# EAGLE design MOSFET (EAGLE 9.6.2)
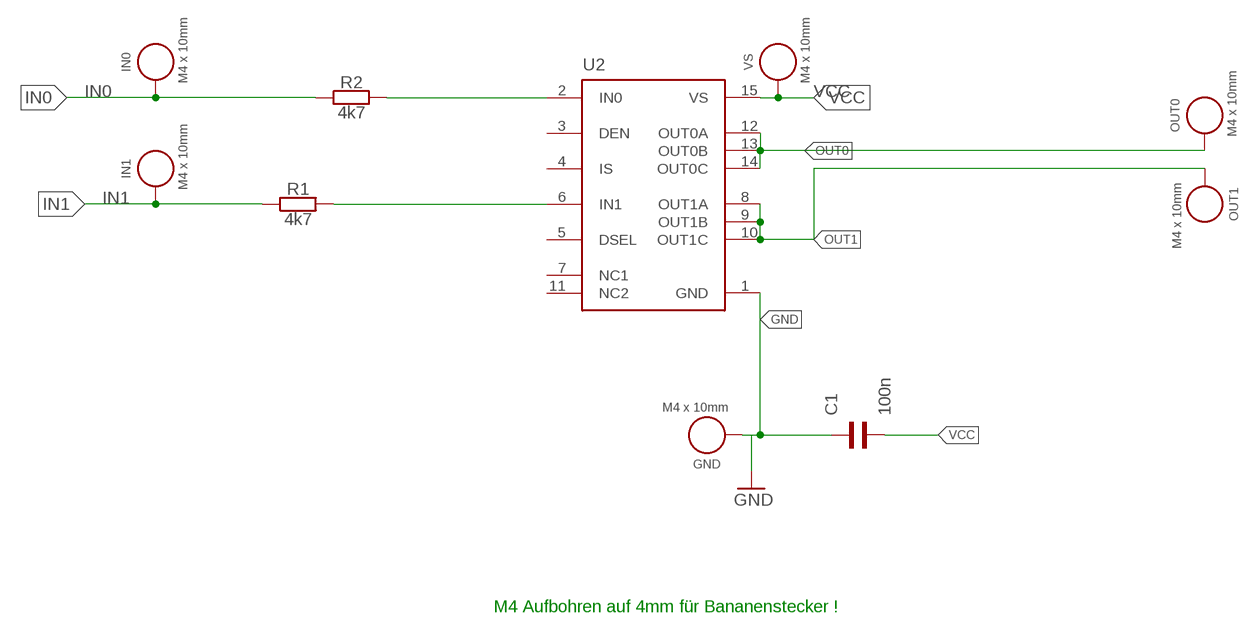
[diagram p0: schematic, sheet 1]

## Parts
C1  100n  WCAP-CSGP_0402_885012205037  [WCAP-CSGP_0402]
GND  M4 x 10mm  WA-SMSI_9774XXX482_9774100482  [WA-SMSI_9774100482]
IN0  M4 x 10mm  WA-SMSI_9774XXX482_9774100482  [WA-SMSI_9774100482]
IN1  M4 x 10mm  WA-SMSI_9774XXX482_9774100482  [WA-SMSI_9774100482]
OUT0  M4 x 10mm  WA-SMSI_9774XXX482_9774100482  [WA-SMSI_9774100482]
OUT1  M4 x 10mm  WA-SMSI_9774XXX482_9774100482  [WA-SMSI_9774100482]
R1  4k7  R-EU_WCAP-CSGP_0402  [WCAP-CSRF_0402]
R2  4k7  R-EU_WCAP-CSGP_0402  [WCAP-CSRF_0402]
U2  BTS7030-2EPA  [SOP65P600X115-15N-V]
VS  M4 x 10mm  WA-SMSI_9774XXX482_9774100482  [WA-SMSI_9774100482]

## Nets
GND: C1.2 GND.1 U2.1(GND)
IN0: IN0.1 R2.1
IN1: IN1.1 R1.1
N$16: R2.2 U2.2(IN0)
N$18: R1.2 U2.6(IN1)
OUT0: OUT0.1 U2.12(OUT0A) U2.13(OUT0B) U2.14(OUT0C)
OUT1: OUT1.1 U2.8(OUT1A) U2.9(OUT1B) U2.10(OUT1C)
VCC: C1.1 U2.15(VS) VS.1
Unconnected: U2.3(DEN) U2.4(IS) U2.5(DSEL) U2.7(NC1) U2.11(NC2)

## Notes on the sheet
- M4 Aufbohren auf 4mm für Bananenstecker !

## Library data of the parts
C1 = Wurth_Elektronik_Passive_Capacitors_rev19a:WCAP-CSGP_0402: WCAP-CSGP Ceramic Capacitors Characteristics Multilayer Ceramic Chip Capacitor Recommended soldering:Reflow, for 0603 and 0805 wave soldering is also allowed Operating temperature:-55 °C to +125 °C; Ceramic characteristics: Class I - NPO ; Class II -X7R, X5R High performance ceramic High capacitance stability Minimal aging Termination:Cu/Ni/Sn <http://katalog.we-online.de/media/images/eisos/WCAP-CSGP_pf2.jpg> Details see: http://katalog.we-online.de/en/pbs/WCAP-CSGP-0402? Created: 2015-01-28 2015 (C) Wurth Elektronik
GND IN0 IN1 OUT0 OUT1 VS = Wurth_Assembly_WA-SMSI:WA-SMSI_9774XXX482: WA-SMSI Steel Spacer with internal Thread M4 Applications Assembling of PCBs to housing and to other PCBs For distances from 1 to 10 mm Fast and precise process Strong holding forces and torques Highest process reliability Instant removable Polyimide Tape Properties Material Steel Surface Tin Ti M4 Solder Paste Thickness 150 µm Tightening Torque (Value) 1.2 N*m General Information Operating Temperature -55 up to +150 °C °C <https://www.we-online.com/catalog/media/o92909v209%20Family_WA_SMSI_M3.jpg> Details see: https://www.we-online.com/catalog/en/SMSI_SMT_STEEL_SPACER_M4_THREAD_INTERNAL Updated by Ella Wu 2021-06-03 2021(C) Wurth Elektronik; DATASHEET-URL: https://www.we-online.com/catalog/datasheet/9774100482.pdf; INNER-DIAMETER: 5.2mm; INNER-THREAD-LENGTH: -; OUTER-DIAMETER: 8.2mm; PART-NUMBER: 9774100482; PIN-LENGTH: 10mm; THREAD: M4
R1 R2 = Resistor_smaller_fliegl:R-EU_: RESISTOR, European symbol
U2 = BTS7030-2EPA:BTS7030-2EPA: BTS7030-2EPA PROFET +2, Smart High-Side Power Switch 30 mOhm Dual Channel SOP65P600X115-15N-V

## Board
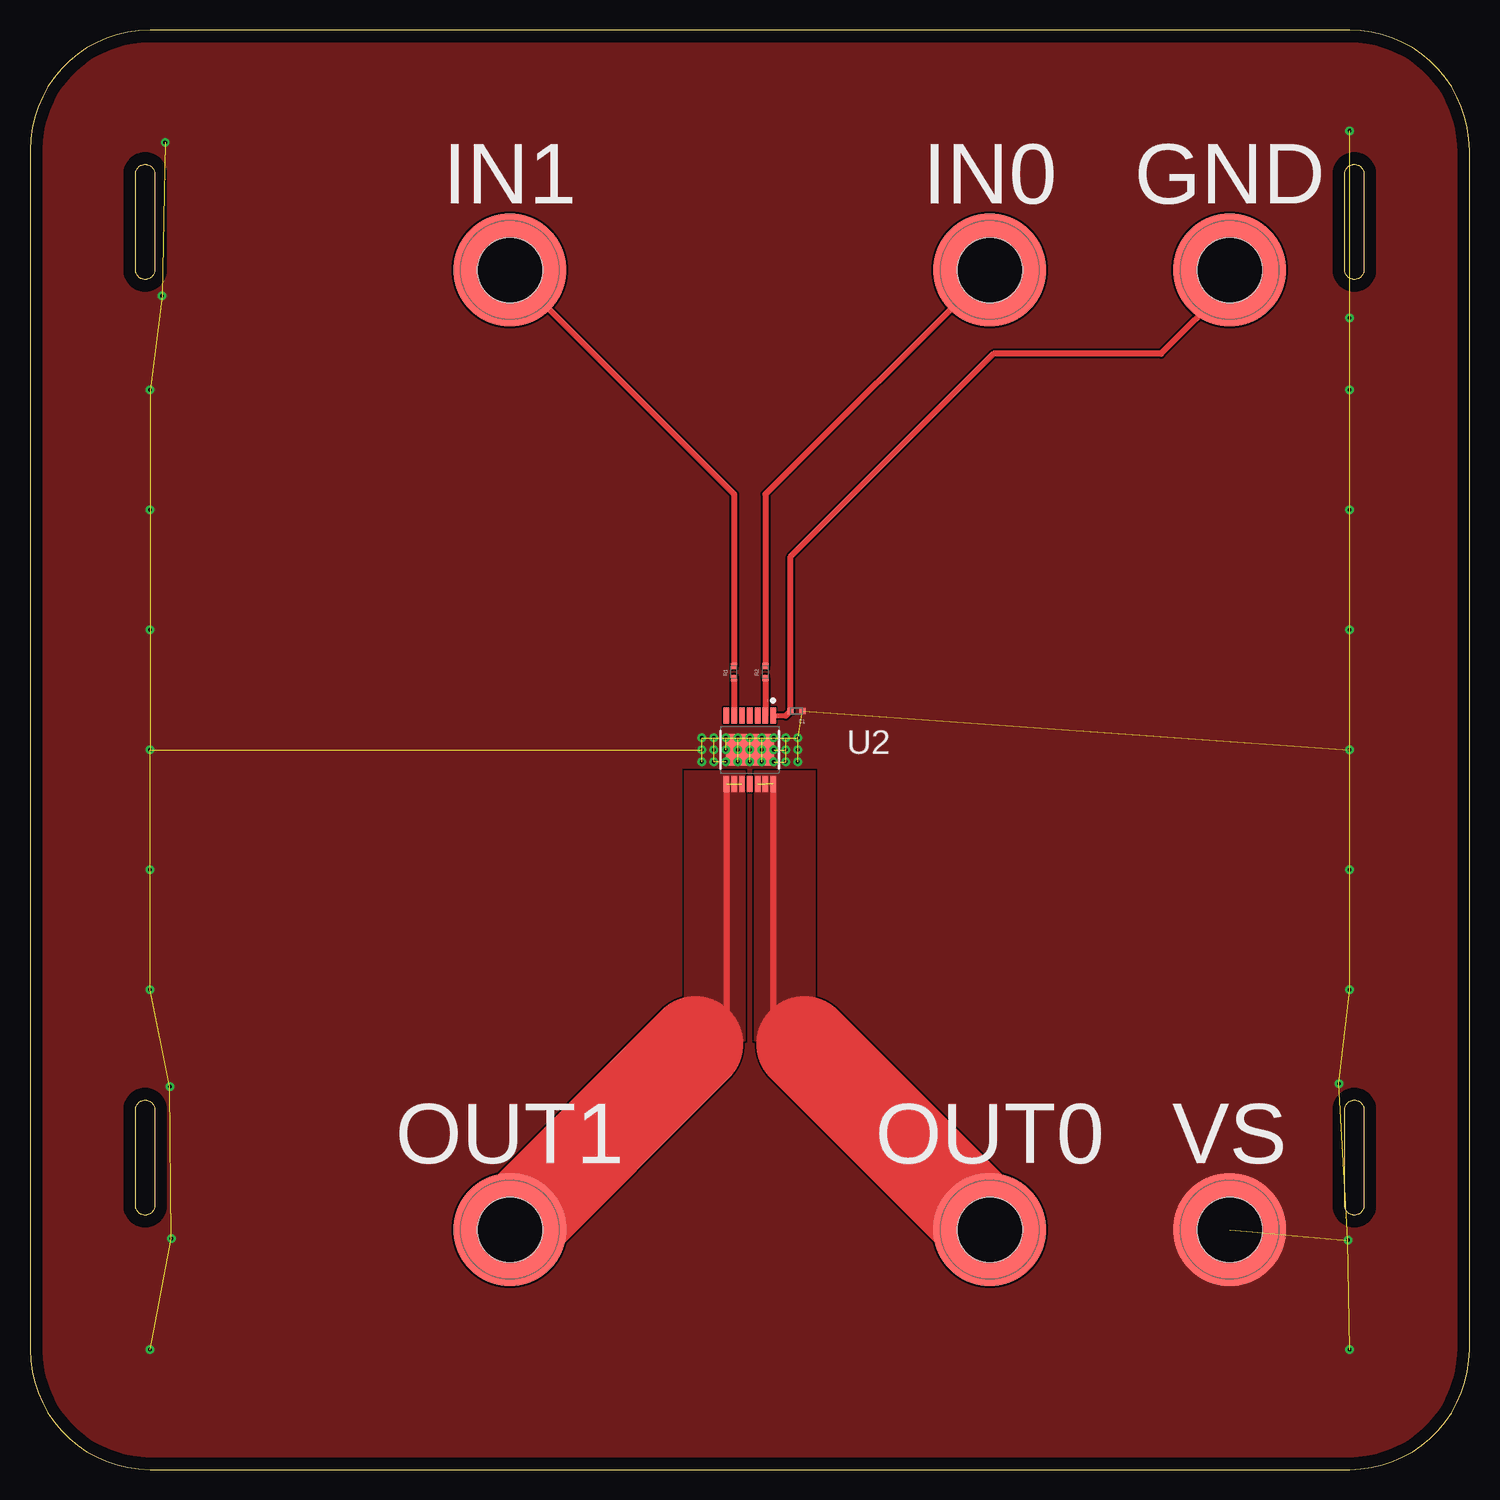
[diagram p1: board, top side]
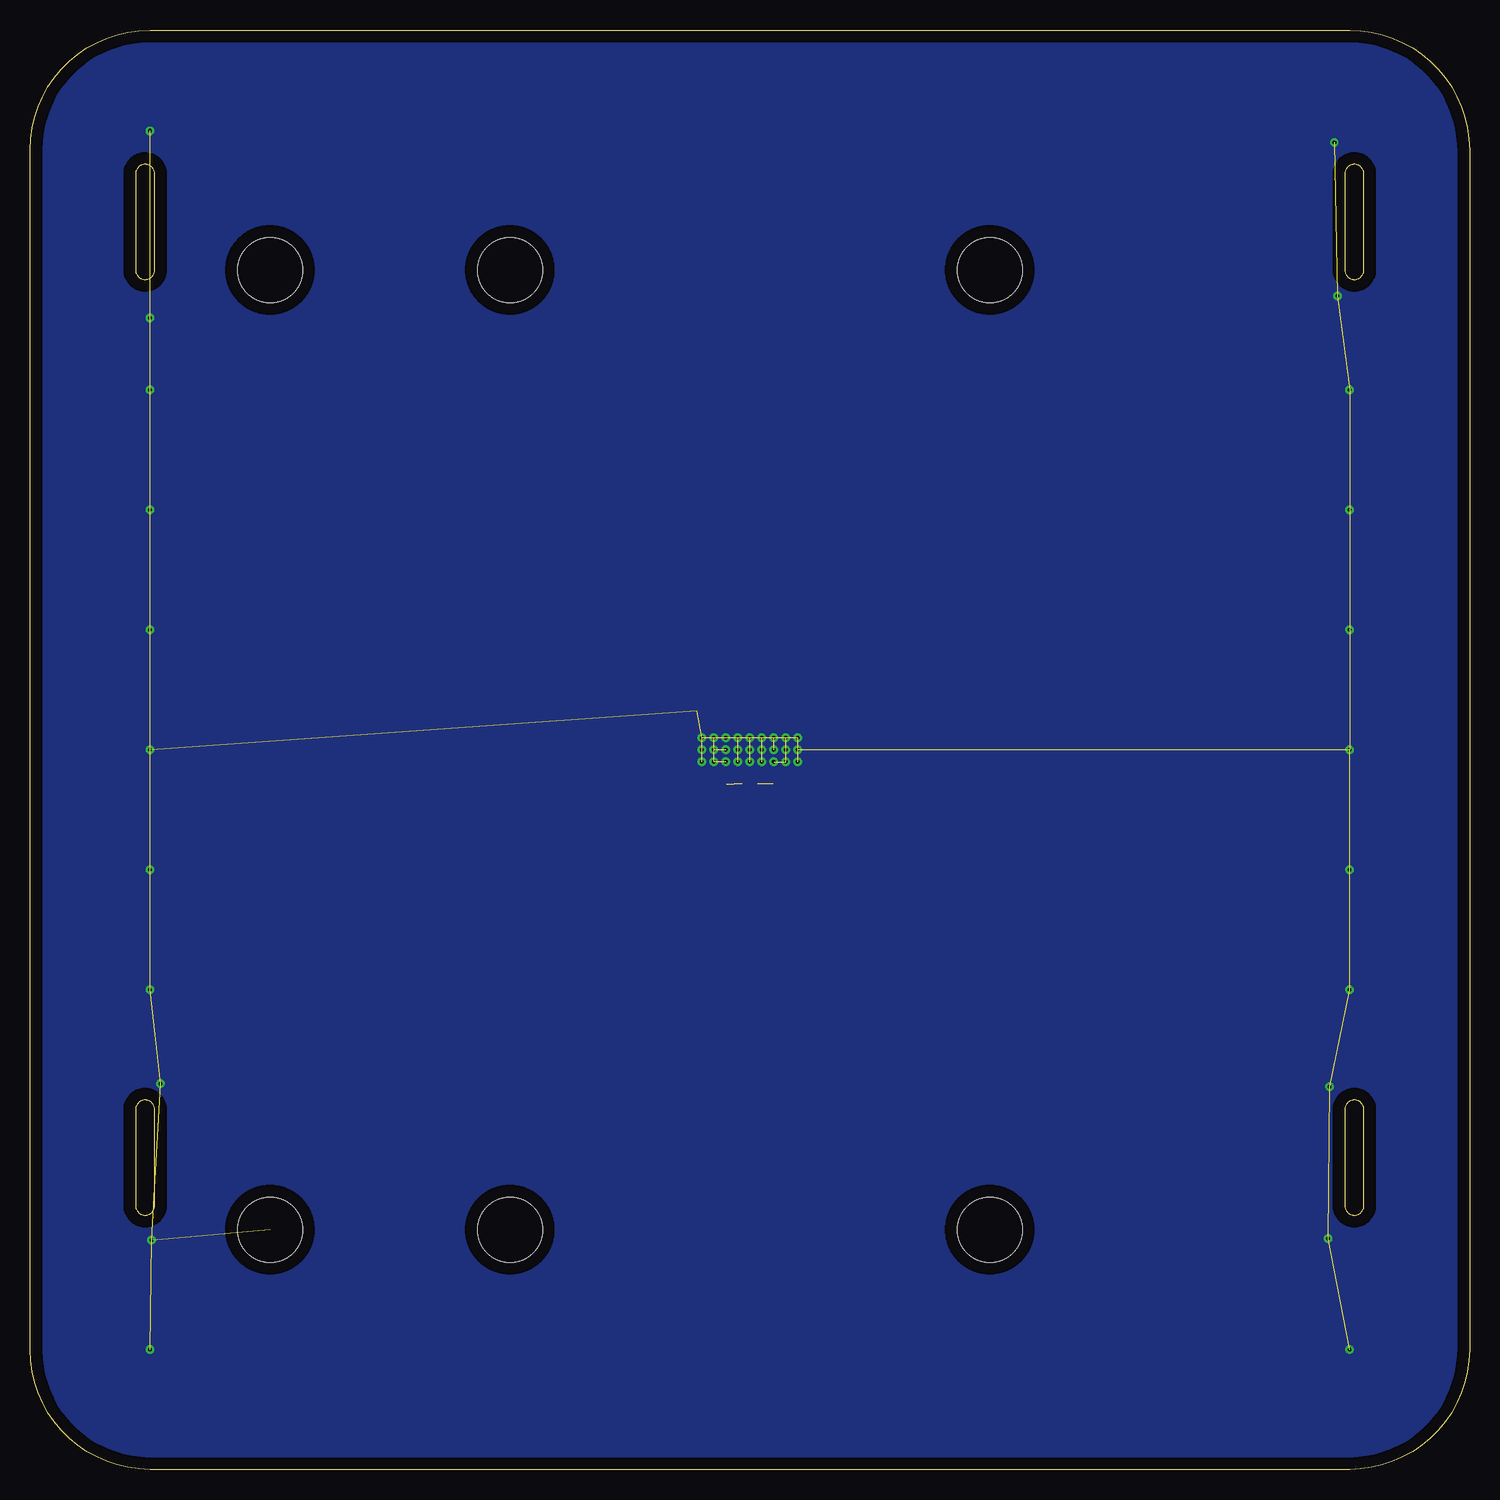
[diagram p2: board, bottom side, seen from below]

Size 120 x 120 mm. Coordinates in mm from the lower left corner, seen from the top.
Outline: 0,110 0,10 arc90 10,0 110,0 arc90 120,10 120,110 arc90 110,120 10,120 arc90 0,110
Outline: 110.4,99.2 arc-90 109.6,100 109.6,108 arc-90 110.4,108.8 arc-90 111.2,108 111.2,100 arc-90 110.4,99.2
Outline: 110.4,21.2 arc-90 109.6,22 109.6,30 arc-90 110.4,30.8 arc-90 111.2,30 111.2,22 arc-90 110.4,21.2
Outline: 9.6,99.2 arc-90 8.8,100 8.8,108 arc-90 9.6,108.8 arc-90 10.4,108 10.4,100 arc-90 9.6,99.2
Outline: 9.6,21.2 arc-90 8.8,22 8.8,30 arc-90 9.6,30.8 arc-90 10.4,30 10.4,22 arc-90 9.6,21.2
Copper layers (1*16): Top 0.035mm / dielectric 1.5mm / Bottom 0.035mm
Design rules "default *": minimum track width 6mil, minimum drill 0.3mm, track to track 6mil, track to pad 6mil, pad to pad 5mil, via to via 6mil, smd to smd 5mil, copper to edge 40mil, drill to drill 6mil, minimum pad ring 10mil, minimum via ring 8mil, stop-mask expansion 4mil, vias tented up to drill 0.5mm, thermal gap 10mil

### Footprints (pad centres in the part's own frame; a part is rotated, then mirrored left to right if it is on the bottom)
WCAP-CSGP_0402 = smd 0.5 x 0.5: 1 -0.5,0; 2 0.5,0
WA-SMSI_9774100482 = smd 9.4 x 9.4: 1 0,0 | hole 5.4: 0,0
WCAP-CSRF_0402 = smd 0.5 x 0.5: 1 0.5,0; 2 -0.5,0
SOP65P600X115-15N-V = smd 1.31 x 0.45: 1 -2.85,1.95; 2 -2.85,1.3; 3 -2.85,0.65; 4 -2.85,0; 5 -2.85,-0.65; 6 -2.85,-1.3; 7 -2.85,-1.95; 8 2.85,-1.95; 9 2.85,-1.3; 10 2.85,-0.65; 11 2.85,0; 12 2.85,0.65; 13 2.85,1.3; 14 2.85,1.95 | smd 2.65 x 4: 15 0,0

### Placement (x,y rotation side)
C1  63.9,63.25 180 top
GND  100,100 0 top
IN0  80,100 0 top
IN1  40,100 0 top
OUT0  80,20 0 top
OUT1  40,20 0 top
R1  58.7,66.5 90 top
R2  61.3,66.5 90 top
U2  60,60 270 top
VS  100,20 0 top

### Tracks (layer width: path | path; a pad name or v marks a point on that pad's centre or on a via)
GND
  Top 0.406: U2.1 63,62.85
  Top 0.508: 63,62.85 C1.2 63.4,76.1 80.32,93.02 94.29,93.02 100,98.73 GND.1
IN0
  Top 0.508: IN0.1 61.3,81.3 R2.1
IN1
  Top 0.508: IN1.1 58.7,81.3 R1.1
N$16
  Top 0.508: R2.2 U2.2
N$18
  Top 0.508: R1.2 U2.6
OUT0  (2 unrouted)
  Top 0.508: U2.14 61.95,38.05 64.55,35.45
  Top 8: 64.55,35.45 OUT0.1
  pour Top (no thermals): 60.45,58.25 65.4,58.25 65.4,35.75 60.45,35.75
OUT1  (2 unrouted)
  Top 0.508: U2.8 58.05,38.05 55.45,35.45
  Top 8: 55.45,35.45 OUT1.1
  pour Top (no thermals): 54.6,58.25 59.55,58.25 59.55,35.75 54.6,35.75
VCC  (via drill 0.3)  (50 unrouted)
  other vias: 56,61 57,61 58,61 59,61 60,61 61,61 62,61 63,61 64,61 64,60 63,60 62,60 61,60 60,60 59,60 58,60 57,60 56,60 56,59 57,59 58,59 59,59 60,59 61,59 62,59 63,59 64,59 10,10 11.78,19.24 11.65,31.91 10,40 10,50 10,60 10,70 10,80 10,90 11.02,97.84 11.27,110.63 110,10 109.87,19.11 109.11,32.16 110,40 110,50 110,60 110,70 110,80 110,90 110,96 110,111.6
  pour Top (rank 2, no thermals): 0,120 120,120 120,0 0,0
  pour Bottom (no thermals): 0,120 120,120 120,0 0,0